# EAGLE design Control Board (EAGLE 6.2)
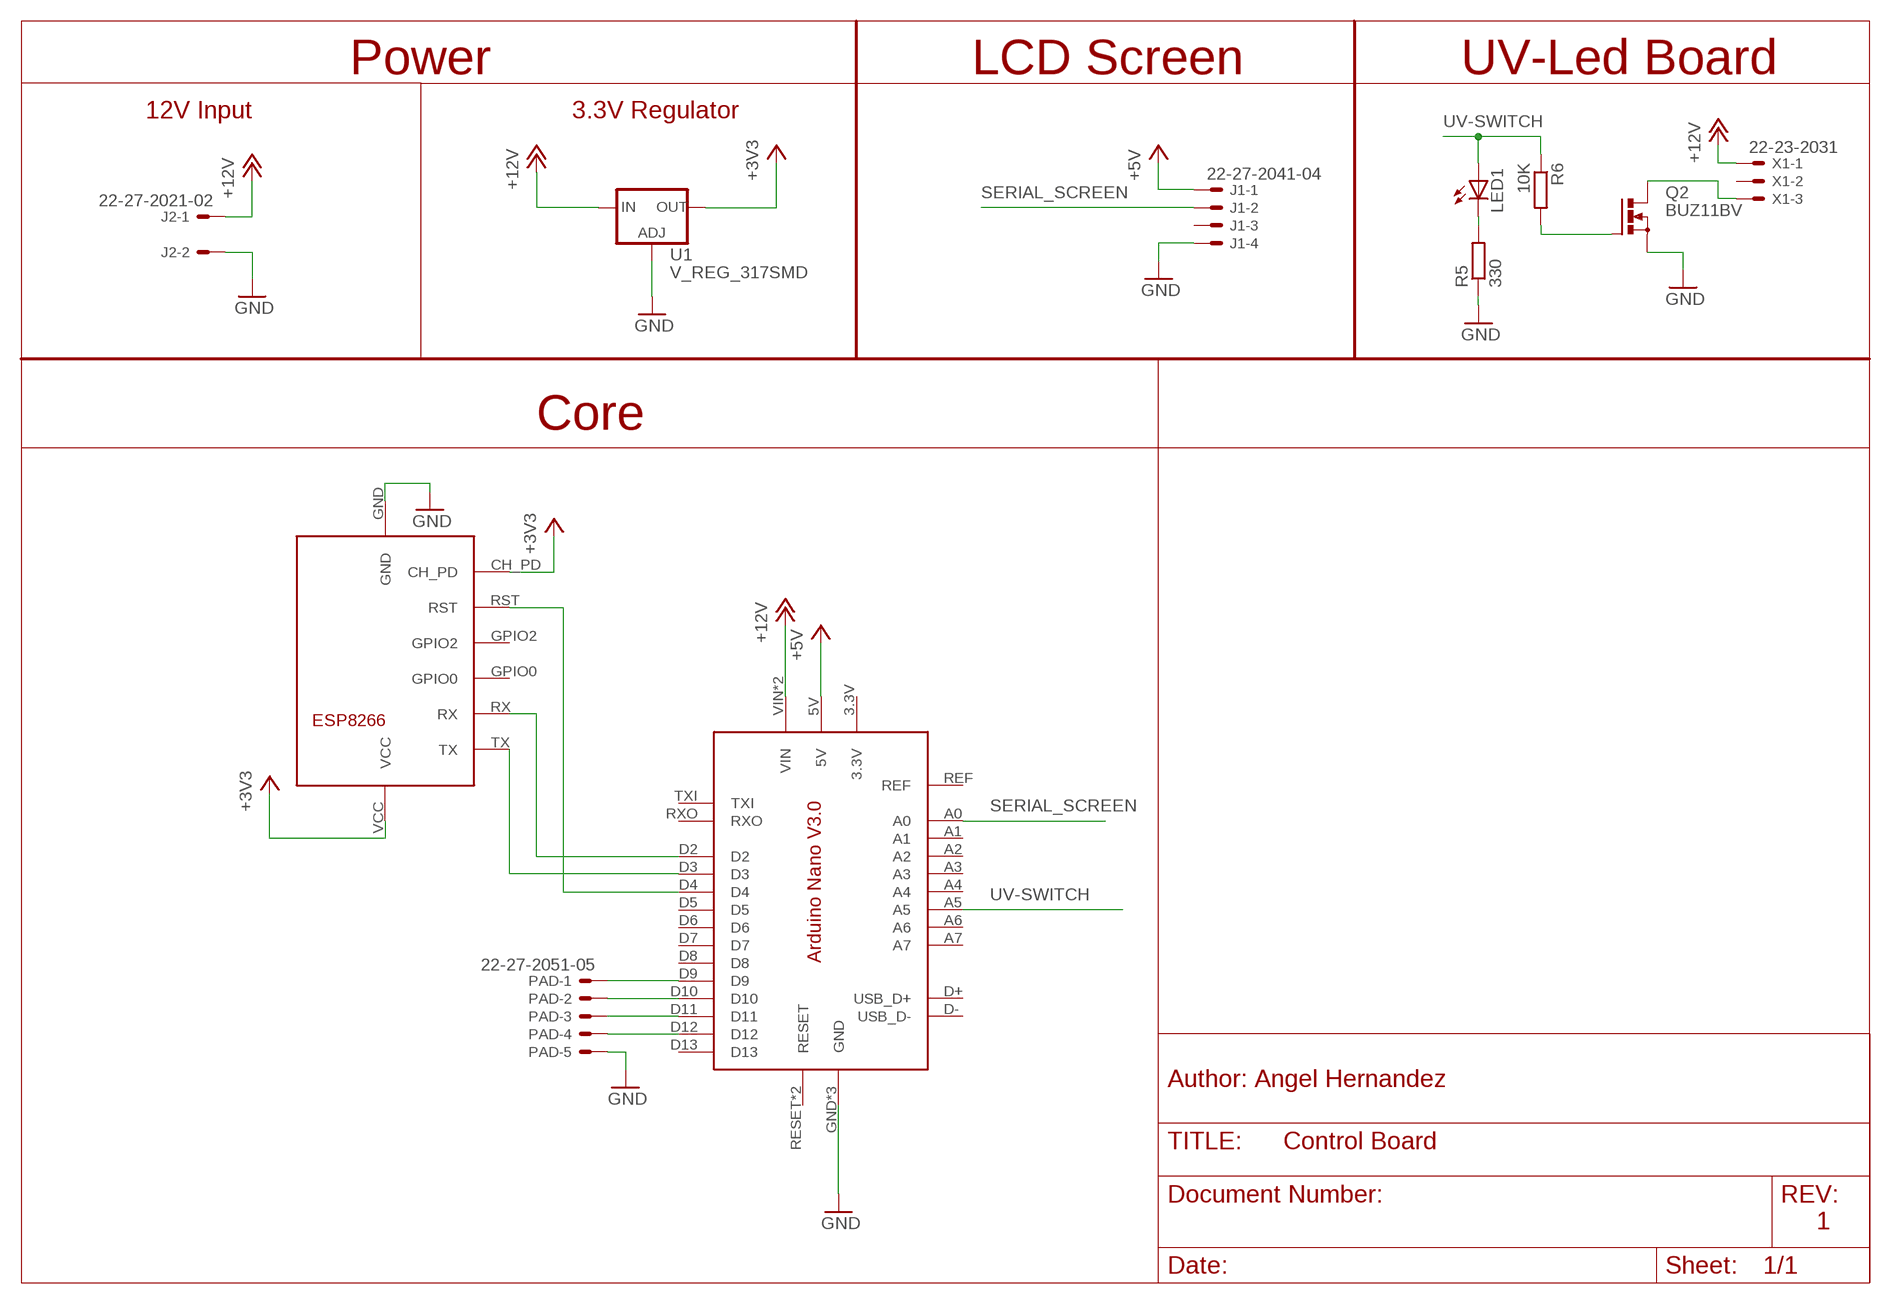
[diagram p0: schematic, sheet 1]

## Parts
J1  22-27-2041-04  [6410-04]
J2  22-27-2021-02  [6410-02]
LED1  LED3MM  [LED3MM]
PAD  22-27-2051-05  [6410-05]
Q2  BUZ11BV  [TO220BV]
R5  330  R-EU_0204/7  [0204/7]
R6  10K  R-EU_0204/7  [0204/7]
U1  V_REG_317SMD  [SOT223]
U$1  ARDUINO_NANO_V3  [ARDUINO_NANO_V3]
U$2  ESP8266  [ESP8266]
X1  22-23-2031  [22-23-2031]

## Nets
+3V3: U1.2(OUT) U$2.CH_PD U$2.VCC
+5V: J1.1 U$1.5V
+12V: J2.1 U1.3(IN) U$1.VIN U$1.VUSB(VIN) X1.1
GND: J1.4 J2.2 PAD.5 Q2.S R5.1 U1.1(ADJ) U$1.GND U$1.GND1(GND) U$1.GND_USB(GND) U$2.GND
N$1: Q2.D X1.3
N$2: U$1.D3 U$2.TX
N$3: U$1.D2 U$2.RX
N$4: PAD.1 U$1.D9
N$5: PAD.2 U$1.D10
N$6: PAD.3 U$1.D11
N$7: PAD.4 U$1.D12
N$8: LED1.K(C) R5.2
N$9: Q2.G R6.2
N$10: U$1.D4 U$2.RST
SERIAL_SCREEN: J1.2 U$1.A0
UV-SWITCH: LED1.A R6.1 U$1.A5
Unconnected: J1.3 U$1.3.3V U$1.A1 U$1.A2 U$1.A3 U$1.A4 U$1.A6 U$1.A7 U$1.D5 U$1.D6 U$1.D7 U$1.D8 U$1.D13 U$1.D+(USB_D+) U$1.D-(USB_D-) U$1.REF U$1.RESET U$1.RESET1(RESET) U$1.RXO U$1.TXI U$2.GPIO0 U$2.GPIO2 X1.2

## Notes on the sheet
- Power | LCD Screen | UV-Led Board
- 12V Input | 3.3V Regulator
- Core
- Author: Angel Hernandez
- 1

## Library data of the parts
J1 = con-molex:22-?-04: CONNECTOR wire to board 2.54 mm (.1 inch) pitch header; OC_FARNELL: unknown; OC_NEWARK: unknown
J2 = con-molex:22-?-02: CONNECTOR wire to board 2.54 mm (.1 inch) pitch header; OC_FARNELL: unknown; OC_NEWARK: unknown
LED1 = led:LED: LED OSRAM: - CHIPLED LG R971, LG N971, LY N971, LG Q971, LY Q971, LO R971, LY R971 LH N974, LH R974 LS Q976, LO Q976, LY Q976 LO Q996 - Hyper CHIPLED LW Q18S LB Q993, LB Q99A, LB R99A - SideLED LS A670, LO A670, LY A670, LG A670, LP A670 LB A673, LV A673, LT A673, LW A673 LH A674 LY A675 LS A676, LA A676, LO A676, LY A676, LW A676 LS A679, LY A679, LG A679 - Hyper Micro SIDELED® LS Y876, LA Y876, LO Y876, LY Y876 LT Y87S - SmartLED LW L88C, LW L88S LB L89C, LB L89S, LG L890 LS L89K, LO L89K, LY L89K LS L896, LA L896, LO L896, LY L896 - TOPLED LS T670, LO T670, LY T670, LG T670, LP T670 LSG T670, LSP T670, LSY T670, LOP T670, LYG T670 LG T671, LOG T671, LSG T671 LB T673, LV T673, LT T673, LW T673 LH T674 LS T676, LA T676, LO T676, LY T676, LB T676, LH T676, LSB T676, LW T676 LB T67C, LV T67C, LT T67C, LS T67K, LO T67K, LY T67K, LW E67C LS E67B, LA E67B, LO E67B, LY E67B, LB E67C, LV E67C, LT E67C LW T67C LS T679, LY T679, LG T679 LS T770, LO T770, LY T770, LG T770, LP T770 LB T773, LV T773, LT T773, LW T773 LH T774 LS E675, LA E675, LY E675, LS T675 LS T776, LA T776, LO T776, LY T776, LB T776 LHGB T686 LT T68C, LB T68C - Hyper Mini TOPLED® LB M676 - Mini TOPLED Santana® LG M470 LS M47K, LO M47K, LY M47K Source: http://www.osram.convergy.de LUXEON: - LUMILED® LXK2-PW12-R00, LXK2-PW12-S00, LXK2-PW14-U00, LXK2-PW14-V00 LXK2-PM12-R00, LXK2-PM12-S00, LXK2-PM14-U00 LXK2-PE12-Q00, LXK2-PE12-R00, LXK2-PE12-S00, LXK2-PE14-T00, LXK2-PE14-U00 LXK2-PB12-K00, LXK2-PB12-L00, LXK2-PB12-M00, LXK2-PB14-N00, LXK2-PB14-P00, LXK2-PB14-Q00 LXK2-PR12-L00, LXK2-PR12-M00, LXK2-PR14-Q00, LXK2-PR14-R00 LXK2-PD12-Q00, LXK2-PD12-R00, LXK2-PD12-S00 LXK2-PH12-R00, LXK2-PH12-S00 LXK2-PL12-P00, LXK2-PL12-Q00, LXK2-PL12-R00 Source: www.luxeon.com KINGBRIGHT: KA-3528ASYC Source: www.kingbright.com
PAD = con-molex:22-?-05: CONNECTOR wire to board 2.54 mm (.1 inch) pitch header; OC_FARNELL: unknown; OC_NEWARK: unknown
Q2 = transistor-power:BUZ11: N-CHANNEL MOS FET
R5 R6 = resistor:R-EU_: RESISTOR, European symbol
U1 = SparkFun-PowerIC:V_REG_317: Voltage Regulator Standard LM317 adjustable voltage regulator. AOI (Adjust Output Input). Google 'LM317 Calculator' for easy to use app to get the two resistor values needed. 240/720 for 5V output. 240/390 for 3.3V output. Spark Fun Electronics SKU : COM-00527
U$1 = MimaZ:ARDUINO_NANO_V3
U$2 = MimaZ:ESP8266
X1 = con-molex:22-23-2031: .100" (2.54mm) Center Header - 3 Pin; MF: MOLEX; MPN: 22-23-2031; OC_FARNELL: 1462950; OC_NEWARK: 30C0862

## Board
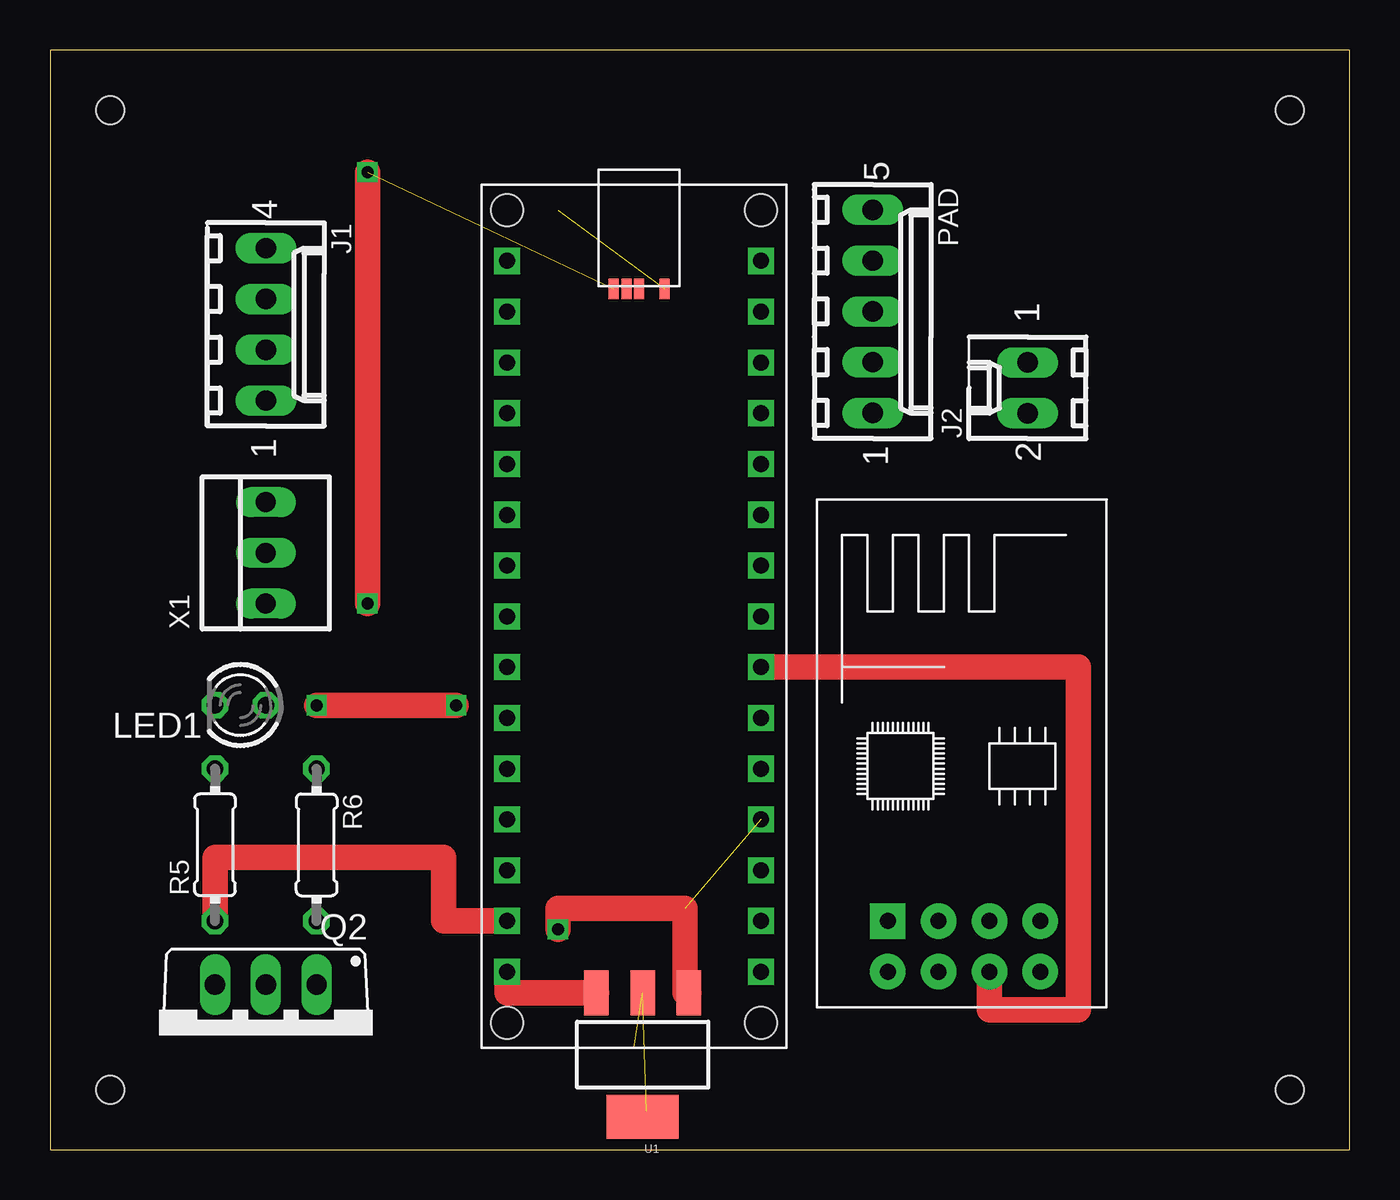
[diagram p1: board, top side]
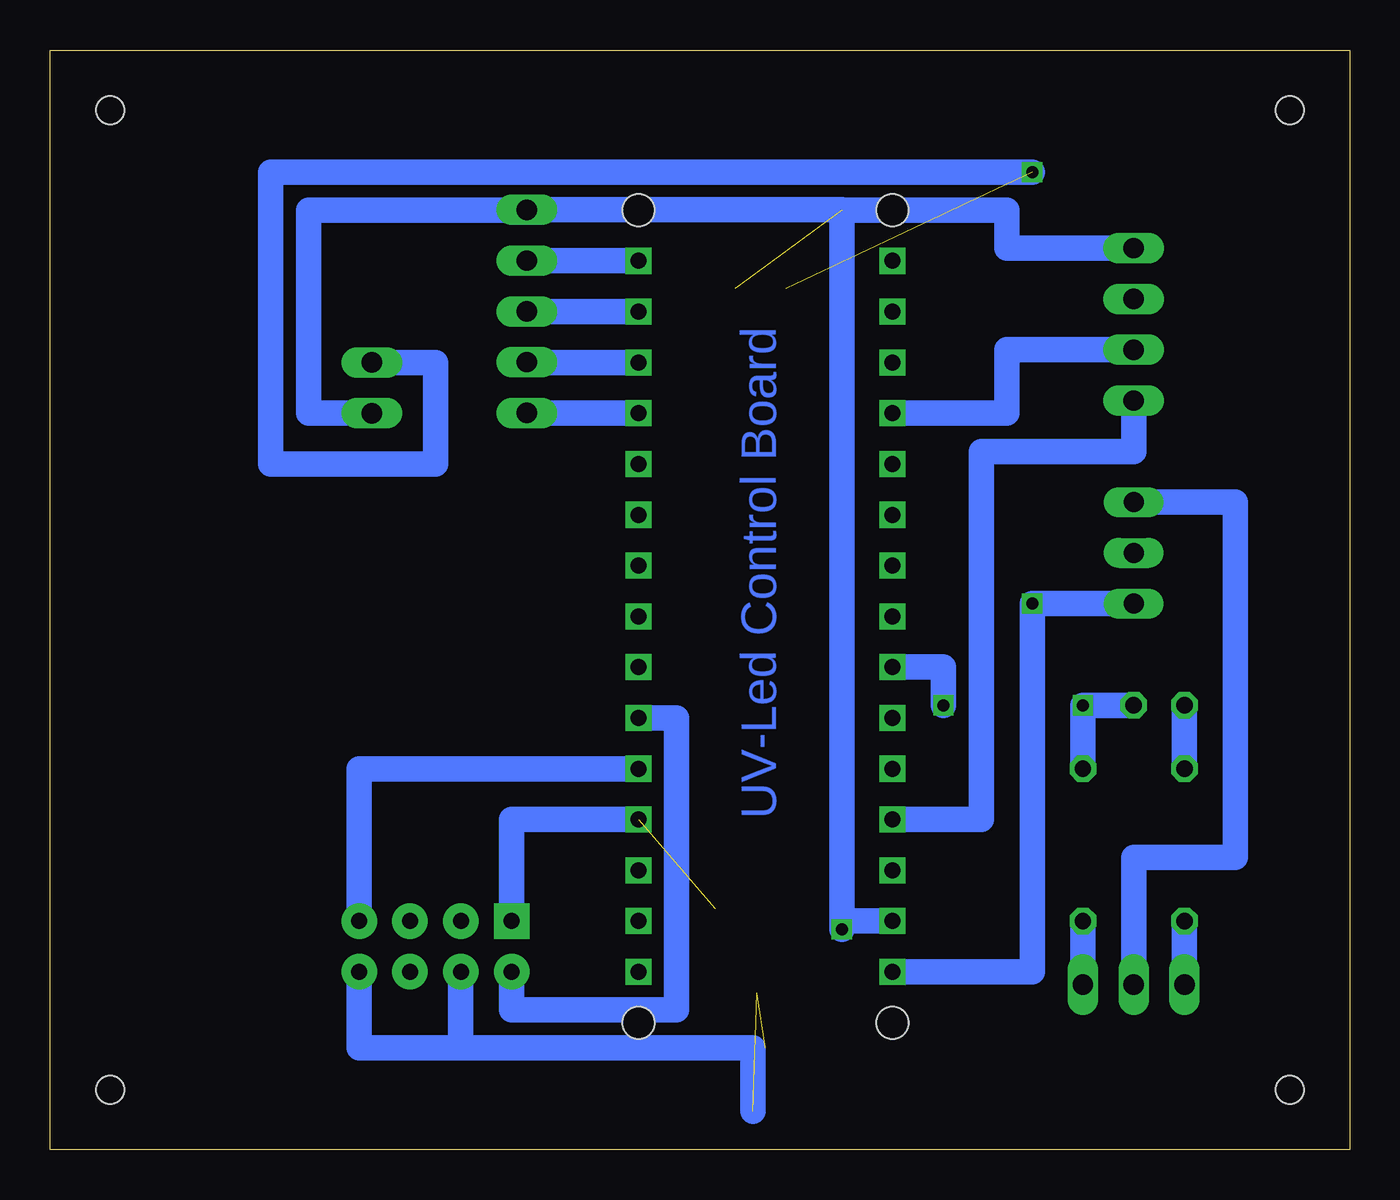
[diagram p2: board, bottom side, seen from below]

Size 65 x 55 mm. Coordinates in mm from the lower left corner, seen from the top.
Outline: 0,0 65,0 65,55 0,55 0,0
Copper layers (1*16): Top 0.035mm / dielectric 1.5mm / Bottom 0.035mm
Design rules: minimum track width 10mil, minimum drill 24mil, track to track 8mil, track to pad 8mil, pad to pad 8mil, via to via 8mil, smd to smd 8mil, copper to edge 40mil, drill to drill 8mil, minimum pad ring 10mil, minimum via ring 8mil, stop-mask expansion 4mil, vias tented up to drill 0mil, thermal gap 10mil
Holes 1.4 mm at 3,52 3,3 62,3 62,52

### Footprints (pad centres in the part's own frame; a part is rotated, then mirrored left to right if it is on the bottom)
6410-04 = drill 1.016 long: 1 3.81,0; 2 1.27,0; 3 -1.27,0; 4 -3.81,0
6410-02 = drill 1.016 long: 1 1.27,0; 2 -1.27,0
LED3MM = drill 0.813 octagon: A -1.27,0; K 1.27,0
6410-05 = drill 1.016 long: 1 5.08,0; 2 2.54,0; 3 0,0; 4 -2.54,0; 5 -5.08,0
TO220BV = drill 1.016 long: D 0,-2.54; G -2.54,-2.54; S 2.54,-2.54
0204/7 = drill 0.813 octagon: 1 -3.81,0; 2 3.81,0
SOT223 = smd 1.219 x 2.235: 1 -2.311,-3.099; 2 0,-3.099; 3 2.311,-3.099 | smd 3.6 x 2.2: 4 0,3.099
ARDUINO_NANO_V3 = drill 0.8 square: 3.3V 12.7,-33.02; 5V 12.7,-7.62; A0 12.7,-27.94; A1 12.7,-25.4; A2 12.7,-22.86; A3 12.7,-20.32; A4 12.7,-17.78; A5 12.7,-15.24; A6 12.7,-12.7; A7 12.7,-10.16; D2 0,-10.16; D3 0,-12.7; D4 0,-15.24; D5 0,-17.78; D6 0,-20.32; D7 0,-22.86; D8 0,-25.4; D9 0,-27.94; D10 0,-30.48; D11 0,-33.02; D12 0,-35.56; D13 12.7,-35.56; GND 0,-7.62; GND1 12.7,-2.54; REF 12.7,-30.48; RESET 0,-5.08; RESET1 12.7,-5.08; RXO 0,-2.54; TXI 0,0; VIN 12.7,0 | smd 0.508 x 1.016: D+ 6.096,-34.163; D- 6.731,-34.163; GND_USB 4.826,-34.163; VUSB 7.366,-34.163 | hole 1.6: 0,2.54; 12.7,2.54; 12.7,-38.1; 0,-38.1
ESP8266 = drill 0.8 pad 1.778: CH_PD 21.59,2.54; GPIO0 19.05,5.08; GPIO2 19.05,2.54; RST 21.59,5.08; RX 19.05,7.62; TX 21.59,0; VCC 21.59,7.62 | drill 0.8 pad 1.778 square: GND 19.05,0
22-23-2031 = drill 1 long: 1 -2.54,0; 2 0,0; 3 2.54,0

### Placement (x,y rotation side)
J1  10.79,41.27 270 top
J2  48.9,38.1 90 top
LED1  9.53,22.23 180 top
PAD  41.15,41.92 270 top
Q2  10.79,5.71 180 top
R5  8.26,15.24 90 top
R6  13.34,15.24 270 top
U1  29.64,4.74 180 top
U$1  35.56,8.89 180 top
U$2  41.91,30.48 270 top
X1  10.79,29.84 90 top

### Tracks (layer width: path | path; a pad name or v marks a point on that pad's centre or on a via)
+3V3  (2 unrouted)
  Bottom 1.27: U$2.VCC 49.53,5.08 44.45,5.08 | U$2.CH_PD 44.45,5.08 | 44.45,5.08 29.84,5.08 29.84,1.91
+5V
  Bottom 1.27: U$1.5V 18.41,16.51 18.41,34.92 10.79,34.92 J1.1
+12V  (via drill 0.6)  (1 unrouted)
  Top 1.27: v15.88,27.3 v15.88,48.9 | U1.3 22.86,7.84 U$1.VIN
  Bottom 1.27: U$1.VIN 15.88,8.89 v15.88,27.3 X1.1 | v15.88,48.9 53.98,48.9 53.98,34.29 45.72,34.29 45.72,39.37 J2.1
GND  (via drill 0.6)  (2 unrouted)
  Top 1.27: U1.1 31.75,7.84 31.75,12.06 25.4,12.06 v25.4,11.01 | R5.1 8.26,14.61 19.68,14.61 19.68,11.43 U$1.GND1
  Bottom 1.27: U$2.GND 41.91,16.51 U$1.GND | Q2.S R5.1 | U$1.GND1 25.4,11.43 | J1.4 17.14,45.09 17.14,46.99 25.4,46.99 | 25.4,11.43 25.4,46.99 | J2.2 52.07,36.83 52.07,46.99 PAD.5 25.4,47 25.4,46.99 | v25.4,11.01 25.4,11.43
N$1
  Bottom 1.27: Q2.D 10.79,14.61 5.71,14.61 5.71,32.38 X1.3
N$2
  Bottom 1.27: U$2.TX 41.91,6.99 33.66,6.99 33.66,21.59 U$1.D3
N$3
  Bottom 1.27: U$2.RX 49.53,19.05 U$1.D2
N$4
  Bottom 1.27: PAD.1 35.56,36.84 U$1.D9
N$5
  Bottom 1.27: U$1.D10 PAD.2
N$6
  Bottom 1.27: PAD.3 35.56,41.92 U$1.D11
N$7
  Bottom 1.27: U$1.D12 PAD.4
N$8
  Bottom 1.27: R5.2 LED1.K
N$9
  Bottom 1.27: Q2.G R6.2
N$10
  Top 1.27: U$2.RST 46.99,6.99 51.44,6.99 51.44,24.13 U$1.D4
SERIAL_SCREEN
  Bottom 1.27: J1.2 17.14,40.01 17.14,36.83 U$1.A0
UV-SWITCH  (via drill 0.6)
  Top 1.27: v20.32,22.23 v13.34,22.23
  Bottom 1.27: LED1.A v13.34,22.23 R6.1 | v20.32,22.23 20.32,24.13 U$1.A5

### Text on the board
Bottom: UV-Led Control Board